# EAGLE design atmega16_with_lcd (EAGLE 7.1.0)
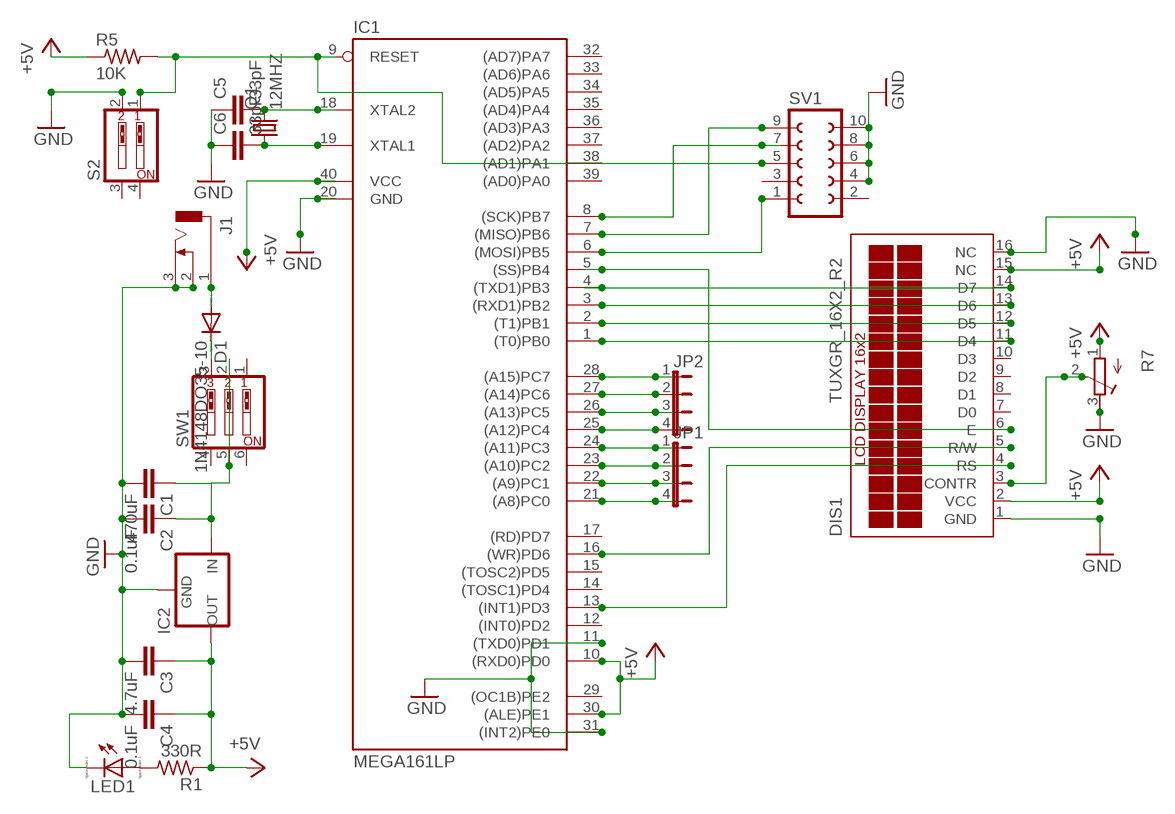
[diagram p0: schematic, sheet 1]

## Parts
C1  470uF  C2.5/4  [C2.5-4]
C2  0.1uF  C2.5/4  [C2.5-4]
C3  4.7uF  C2.5/4  [C2.5-4]
C4  0.1uF  C2.5/4  [C2.5-4]
C5  33pF  C2.5/4  [C2.5-4]
C6  33pF  C2.5/4  [C2.5-4]
D1  1N4148DO35-10  [DO35-10]
DIS1  TUXGR_16X2_R2  [TUXGR_16X2_R2]
IC1  MEGA161LP  [DIL40]
IC2  78XXS  [78XXS]
J1  DCJ0303  [DCJ0303]
JP1  JP4E  [JP4]
JP2  JP4E  [JP4]
LED1  LED_ELD260  [LED_LD260]
Q1  12MHZ  CRYSTALHC49U-V  [HC49U-V]
R1  330R  R-US_0204/7  [0204/7]
R5  10K  R-US_0204/7  [0204/7]
R7  R-TRIMM3339P  [RTRIM3339P]
S2  SW_DIP-2  [EDG-02]
SV1  FE05-2  [FE05-2]
SW1  SW_DIP-3  [EDG-03]

## Nets
+5V: C3.1 C4.1 DIS1.2(VCC) DIS1.15(NC) IC1.10((RXD0)PD0) IC1.30((ALE)PE1) IC1.40(VCC) IC2.OUT R1.1 R5.1 R7.1(E)
GND: C1.2 C2.2 C3.2 C4.2 C5.1 C6.1 DIS1.1(GND) DIS1.16(NC) IC1.11((TXD0)PD1) IC1.20(GND) IC1.31((INT2)PE0) IC2.GND J1.2 J1.3 LED1.K(C) R7.3(A) S2.2 SV1.4 SV1.6 SV1.8 SV1.10
N$1: D1.A J1.1
N$2: IC1.28((A15)PC7) JP2.1
N$3: C5.2 IC1.18(XTAL2) Q1.2
N$4: C6.2 IC1.19(XTAL1) Q1.1
N$5: LED1.A R1.2
N$6: IC1.9(RESET) R5.2 S2.1 SV1.5
N$7: DIS1.3(CONTR) R7.2(S)
N$8: D1.C SW1.3
N$9: C1.1 C2.1 IC2.IN SW1.2 SW1.5
N$10: DIS1.11(D4) IC1.1((T0)PB0)
N$11: DIS1.12(D5) IC1.2((T1)PB1)
N$12: DIS1.13(D6) IC1.3((RXD1)PB2)
N$13: DIS1.14(D7) IC1.4((TXD1)PB3)
N$14: DIS1.4(RS) IC1.13((INT1)PD3)
N$15: DIS1.5(R/W) IC1.16((WR)PD6)
N$16: DIS1.6(E) IC1.5((SS)PB4)
N$17: IC1.27((A14)PC6) JP2.2
N$18: IC1.26((A13)PC5) JP2.3
N$19: IC1.25((A12)PC4) JP2.4
N$20: IC1.24((A11)PC3) JP1.1
N$21: IC1.23((A10)PC2) JP1.2
N$22: IC1.22((A9)PC1) JP1.3
N$23: IC1.21((A8)PC0) JP1.4
N$24: IC1.6((MOSI)PB5) SV1.1
N$25: IC1.7((MISO)PB6) SV1.9
N$26: IC1.8((SCK)PB7) SV1.7
Unconnected: DIS1.7(D0) DIS1.8(D1) DIS1.9(D2) DIS1.10(D3) IC1.12((INT0)PD2) IC1.14((TOSC1)PD4) IC1.15((TOSC2)PD5) IC1.17((RD)PD7) IC1.29((OC1B)PE2) IC1.32((AD7)PA7) IC1.33((AD6)PA6) IC1.34((AD5)PA5) IC1.35((AD4)PA4) IC1.36((AD3)PA3) IC1.37((AD2)PA2) IC1.38((AD1)PA1) IC1.39((AD0)PA0) S2.3 S2.4 SV1.2 SV1.3 SW1.1 SW1.4 SW1.6

## Library data of the parts
C1-C6 = capacitor-wima:C: CAPACITOR naming: grid - package width
D1 = diode:1N4148: DIODE high speed (Philips)
DIS1 = display-lcd:TUXGR_16X2_R2: Tuxgraphics LCD display 16x2 characters reflective, without background light Source: tuxgr_12x2_r2.pdf; OC_FARNELL: unknown; OC_NEWARK: unknown
IC1 = atmel:MEGA161*P: MICROCONTROLLER 16 Kbytes FLASH 512 bytes EEPROM 1 Kbytes SRAM dual UART hardware multiplier Source: avr.lbr; MPN: ATMEGA16-16PU; OC_FARNELL: 9171142; OC_NEWARK: 98M0167
IC2 = v-reg:78XXS: VOLTAGE REGULATOR
J1 = con-jack:DCJ0303: DC POWER JACK Source: DCJ0303.pdf; OC_FARNELL: unknown; OC_NEWARK: unknown
JP1 JP2 = jumper:JP4E: JUMPER
LED1 = eagle-ltspice:LED_E: LED Source: http://www.osram.convergy.de Source: www.luxeon.com Source: www.kingbright.com; SPICEMODEL: NONE; SPICEPREFIX: D; SPICETYPE: diode
Q1 = crystal:CRYSTAL: CRYSTAL; OC_FARNELL: 1666969; OC_NEWARK: unknown
R1 R5 = resistor:R-US_: RESISTOR, American symbol
R7 = resistor:R-TRIMM: Trimm resistor
S2 = special:SW_DIP-2: DIP SWITCH
SV1 = con-lsta:FE05-2: FEMALE HEADER; OC_FARNELL: unknown; OC_NEWARK: unknown
SW1 = special:SW_DIP-3: DIP SWITCH

## Board
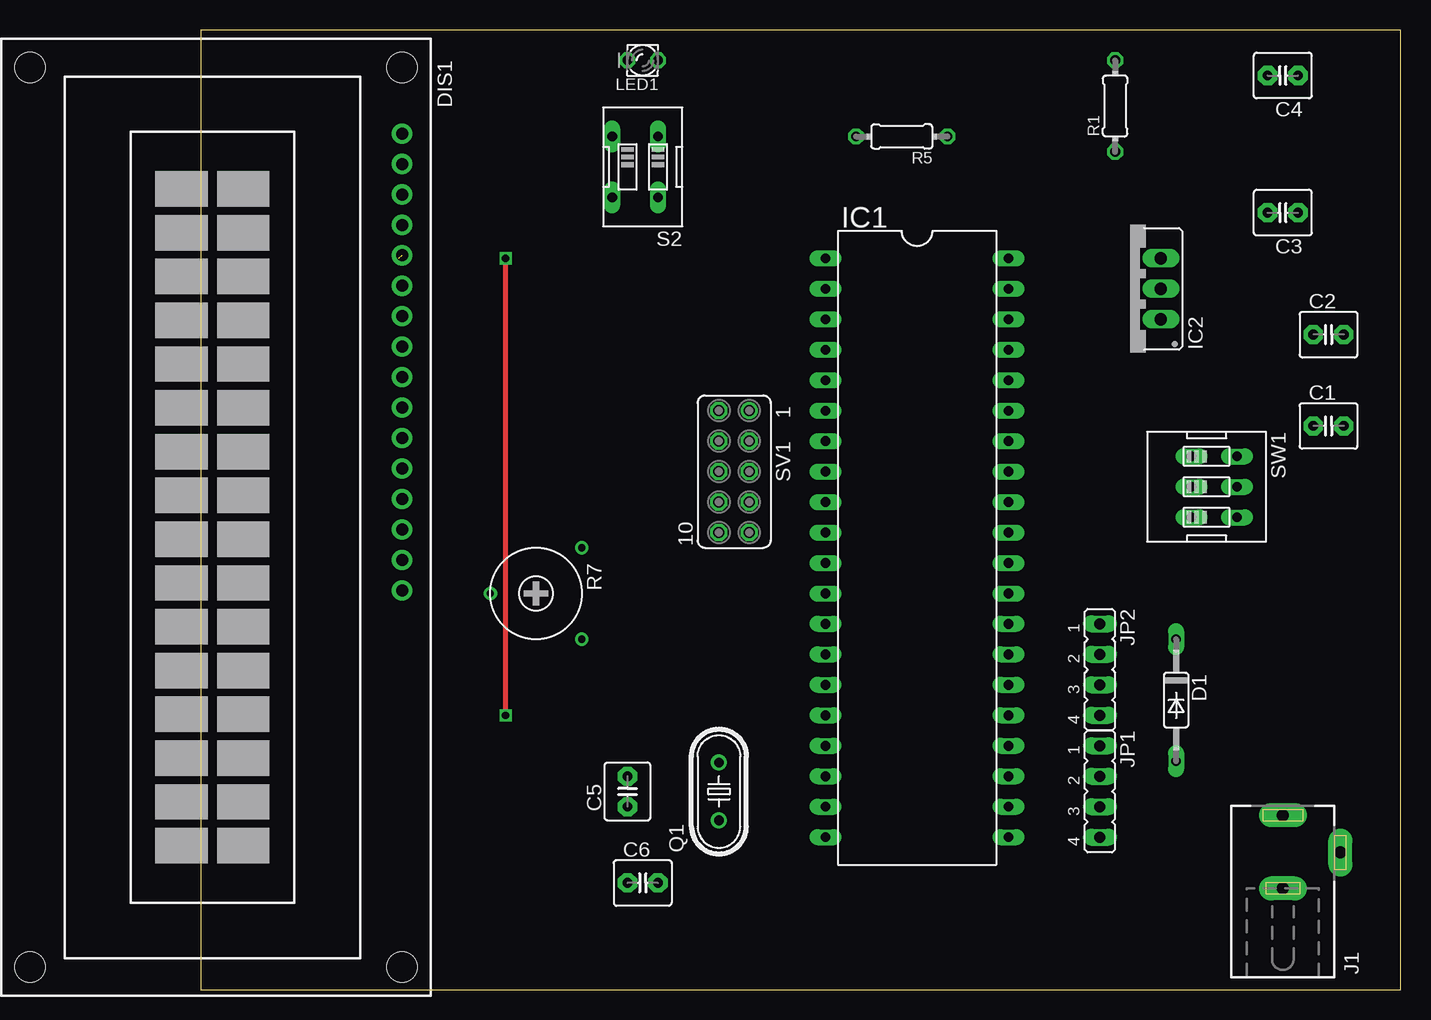
[diagram p1: board, top side]
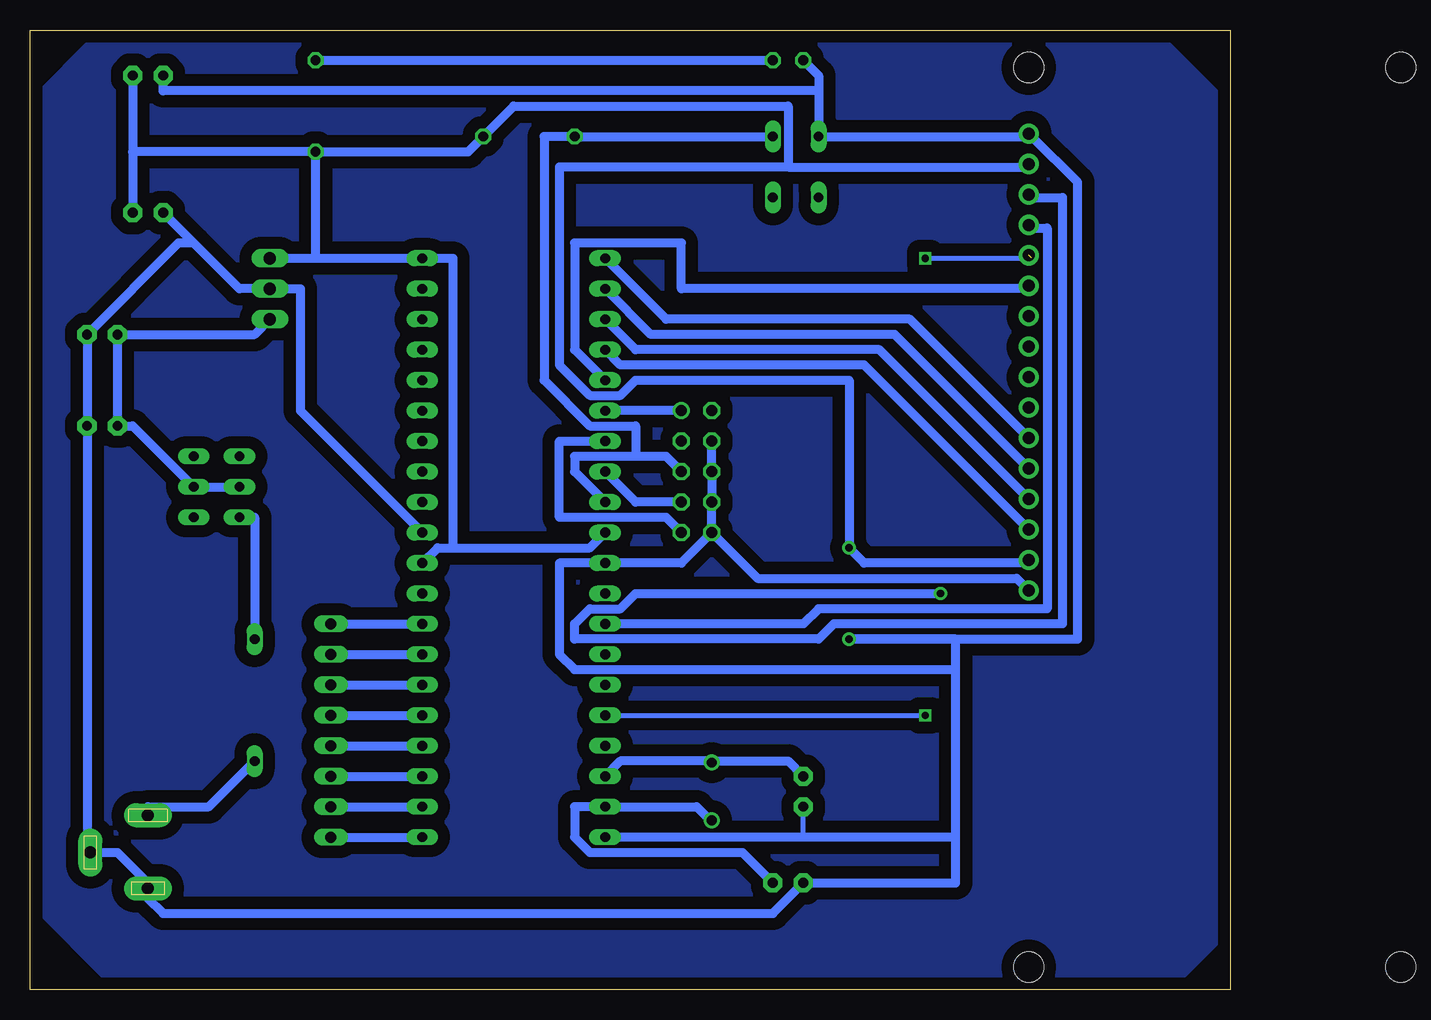
[diagram p2: board, bottom side, seen from below]

Size 100 x 80 mm. Coordinates in mm from the lower left corner, seen from the top.
Outline: 0,0 100,0 100,80 0,80 0,0
Copper layers (1*16): Top 0.035mm / dielectric 1.5mm / Bottom 0.035mm
Design rules "default": minimum track width 30mil, minimum drill 24mil, track to track 8mil, track to pad 8mil, pad to pad 8mil, via to via 8mil, smd to smd 8mil, copper to edge 40mil, drill to drill 8mil, minimum pad ring 10mil, minimum via ring 8mil, stop-mask expansion 4mil, vias tented up to drill 0mil, thermal gap 10mil

### Footprints (pad centres in the part's own frame; a part is rotated, then mirrored left to right if it is on the bottom)
C2.5-4 = drill 0.813 pad 1.6 octagon: 1 -1.27,0; 2 1.27,0
DO35-10 = drill 0.813 long: A 5.08,0; C -5.08,0
TUXGR_16X2_R2 = drill 1 pad 1.676: 1 -32,15.5; 2 -29.46,15.5; 3 -26.92,15.5; 4 -24.38,15.5; 5 -21.84,15.5; 6 -19.3,15.5; 7 -16.76,15.5; 8 -14.22,15.5; 9 -11.68,15.5; 10 -9.14,15.5; 11 -6.6,15.5; 12 -4.06,15.5; 13 -1.52,15.5; 14 1.02,15.5; 15 3.56,15.5; 16 6.1,15.5 | hole 2.5: -37.5,-15.5; 37.5,-15.5; -37.5,15.5; 37.5,15.5
DIL40 = drill 0.813 long: 1 -24.13,-7.62; 2 -21.59,-7.62; 3 -19.05,-7.62; 4 -16.51,-7.62; 5 -13.97,-7.62; 6 -11.43,-7.62; 7 -8.89,-7.62; 8 -6.35,-7.62; 9 -3.81,-7.62; 10 -1.27,-7.62; 11 1.27,-7.62; 12 3.81,-7.62; 13 6.35,-7.62; 14 8.89,-7.62; 15 11.43,-7.62; 16 13.97,-7.62; 17 16.51,-7.62; 18 19.05,-7.62; 19 21.59,-7.62; 20 24.13,-7.62; 21 24.13,7.62; 22 21.59,7.62; 23 19.05,7.62; 24 16.51,7.62; 25 13.97,7.62; 26 11.43,7.62; 27 8.89,7.62; 28 6.35,7.62; 29 3.81,7.62; 30 1.27,7.62; 31 -1.27,7.62; 32 -3.81,7.62; 33 -6.35,7.62; 34 -8.89,7.62; 35 -11.43,7.62; 36 -13.97,7.62; 37 -16.51,7.62; 38 -19.05,7.62; 39 -21.59,7.62; 40 -24.13,7.62
78XXS = drill 1.016 long: GND 0,-2.54; IN -2.54,-2.54; OUT 2.54,-2.54
DCJ0303 = drill 1 pad 2 long: 1 0,3.1; 2 4.8,0; 3 0,-3
JP4 = drill 0.914 long: 1 -3.81,0; 2 -1.27,0; 3 1.27,0; 4 3.81,0
LED_LD260 = drill 0.813 octagon: A -1.27,0; K 1.27,0
HC49U-V = drill 0.813: 1 -2.413,0; 2 2.413,0
0204/7 = drill 0.813 octagon: 1 -3.81,0; 2 3.81,0
RTRIM3339P = drill 0.61: 1 -3.81,3.81; 2 0,-3.81; 3 3.81,3.81
EDG-02 = drill 0.813 long: 1 -1.27,-2.54; 2 2.54,-2.54; 3 2.54,2.54; 4 -1.27,2.54
FE05-2 = drill 0.914: 1 -5.08,1.27 | drill 0.914 octagon: 2 -5.08,-1.27; 3 -2.54,1.27; 4 -2.54,-1.27; 5 0,1.27; 6 0,-1.27; 7 2.54,1.27; 8 2.54,-1.27; 9 5.08,1.27; 10 5.08,-1.27
EDG-03 = drill 0.813 long: 1 -2.54,-1.27; 2 0,-1.27; 3 2.54,-1.27; 4 2.54,2.54; 5 0,2.54; 6 -2.54,2.54

### Placement (x,y rotation side)
C1  93.98,46.99 0 top
C2  93.98,54.61 0 top
C3  90.17,64.77 180 top
C4  90.17,76.2 180 top
C5  35.56,16.51 90 top
C6  36.83,8.89 0 top
D1  81.28,24.13 270 top
DIS1  1.27,39.37 270 top
IC1  59.69,36.83 270 top
IC2  77.47,58.42 90 top
J1  90.17,11.43 0 top
JP1  74.93,16.51 270 top
JP2  74.93,26.67 270 top
LED1  36.83,77.47 180 top
Q1  43.18,16.51 90 top
R1  76.2,73.66 90 top
R5  58.42,71.12 180 top
R7  27.94,33.02 270 top
S2  36.83,68.58 180 top
SV1  44.45,43.18 270 top
SW1  83.82,41.91 270 top

### Tracks (layer width: path | path; a pad name or v marks a point on that pad's centre or on a via)
+5V
  Bottom 0.762: IC1.10 53.34,36.83 64.77,36.83 | 64.77,36.83 66.04,36.83 IC1.30 | DIS1.15 16.51,35.56 30.48,35.56 R7.1 31.75,50.8 49.53,50.8 50.8,49.53 53.34,49.53 55.88,52.07 55.88,68.58 36.83,68.58 | C4.1 91.44,69.85 | 91.44,69.85 C3.1 | IC2.OUT 76.2,60.96 | 76.2,60.96 IC1.40 64.77,60.96 64.77,36.83 | 76.2,60.96 R1.1 | R1.1 63.5,69.85 R5.1 59.69,73.66 36.83,73.66 36.83,68.58 | 36.83,68.58 16.51,68.58 DIS1.2 | R1.1 91.44,69.85
GND
  Bottom 0.406: 22.86,12.7 35.56,12.7 C5.1
  Bottom 0.762: LED1.K 34.29,76.2 34.29,74.93 | 34.29,74.93 S2.2 16.51,71.12 | 34.29,74.93 88.9,74.93 C4.2 | 22.86,12.7 22.86,8.89 C6.1 38.1,6.35 88.9,6.35 90.17,7.62 J1.3 90.17,8.89 92.71,11.43 J1.2 95.25,11.43 C1.2 C2.2 87.63,62.23 86.36,62.23 | 22.86,12.7 22.86,26.67 | 22.86,26.67 22.86,29.21 R7.3 12.7,29.21 12.7,67.31 16.51,71.12 | 22.86,12.7 IC1.20 | SV1.4 SV1.6 SV1.8 SV1.10 | SV1.10 45.72,35.56 IC1.11 55.88,35.56 55.88,27.94 54.61,26.67 22.86,26.67 | SV1.10 39.37,34.29 17.78,34.29 16.51,33.02 DIS1.16 | IC1.31 77.47,48.26 77.47,58.42 IC2.GND 82.55,58.42 86.36,62.23 | 86.36,62.23 C3.2 | 16.51,71.12 DIS1.1
N$1
  Bottom 0.762: D1.A 85.09,15.24 90.17,15.24 J1.1
N$2
  Bottom 0.762: JP2.1 IC1.28
N$3
  Bottom 0.762: IC1.18 50.8,19.05 43.18,19.05 | C5.2 36.83,19.05 43.18,19.05 | 43.18,19.05 Q1.2
N$4
  Bottom 0.762: Q1.1 43.18,13.97 44.45,15.24 IC1.19 54.61,15.24 54.61,12.7 53.34,11.43 40.64,11.43 C6.2
N$5
  Bottom 0.762: R1.2 LED1.A
N$6
  Bottom 0.762: IC1.9 54.61,43.18 54.61,44.45 49.53,44.45 | 49.53,44.45 46.99,44.45 SV1.5 | S2.1 R5.2 57.15,71.12 57.15,50.8 53.34,46.99 49.53,46.99 49.53,44.45
N$7
  Bottom 0.762: R7.2 49.53,33.02 50.8,31.75 53.34,31.75 54.61,30.48 54.61,29.21 34.29,29.21 33.02,30.48 13.97,30.48 13.97,66.04 16.51,66.04 DIS1.3
N$8
  Bottom 0.762: D1.C 81.28,39.37 SW1.3
N$9
  Bottom 0.762: SW1.2 SW1.5 91.44,46.99 C1.1 C2.1 81.28,54.61 IC2.IN
N$10
  Bottom 0.762: IC1.1 46.99,55.88 26.67,55.88 16.51,45.72 DIS1.11
N$11
  Bottom 0.762: IC1.2 48.26,54.61 27.94,54.61 16.51,43.18 DIS1.12
N$12
  Bottom 0.762: IC1.3 49.53,53.34 29.21,53.34 16.51,40.64 DIS1.13
N$13
  Bottom 0.762: IC1.4 50.8,52.07 30.48,52.07 16.51,38.1 DIS1.14
N$14
  Bottom 0.762: IC1.13 35.56,30.48 34.29,31.75 15.24,31.75 15.24,63.5 16.51,63.5 DIS1.4
N$15  (via drill 0.6)  (1 unrouted)
  Top 0.406: v25.4,22.86 v25.4,60.96
  Bottom 0.406: IC1.16 v25.4,22.86 | v25.4,60.96 16.51,60.96
N$16
  Bottom 0.762: IC1.5 54.61,53.34 54.61,62.23 45.72,62.23 45.72,58.42 16.51,58.42 DIS1.6
N$17
  Bottom 0.762: JP2.2 IC1.27
N$18
  Bottom 0.762: JP2.3 IC1.26
N$19
  Bottom 0.762: JP2.4 IC1.25
N$20
  Bottom 0.762: JP1.1 IC1.24
N$21
  Bottom 0.762: JP1.2 IC1.23
N$22
  Bottom 0.762: JP1.3 IC1.22
N$23
  Bottom 0.762: JP1.4 IC1.21
N$24
  Bottom 0.762: SV1.1 IC1.6
N$25
  Bottom 0.762: IC1.7 55.88,45.72 55.88,39.37 46.99,39.37 SV1.9
N$26
  Bottom 0.762: IC1.8 49.53,40.64 SV1.7
N$27
  pour Bottom (isolate 1.016): 8.89,0 5.08,0 0,5.08 0,73.66 6.35,80.01 93.98,80.01 100.33,73.66 100.33,7.62 92.71,0